# EAGLE design MySXMotion-V1.2-001 (EAGLE 9.1.0)
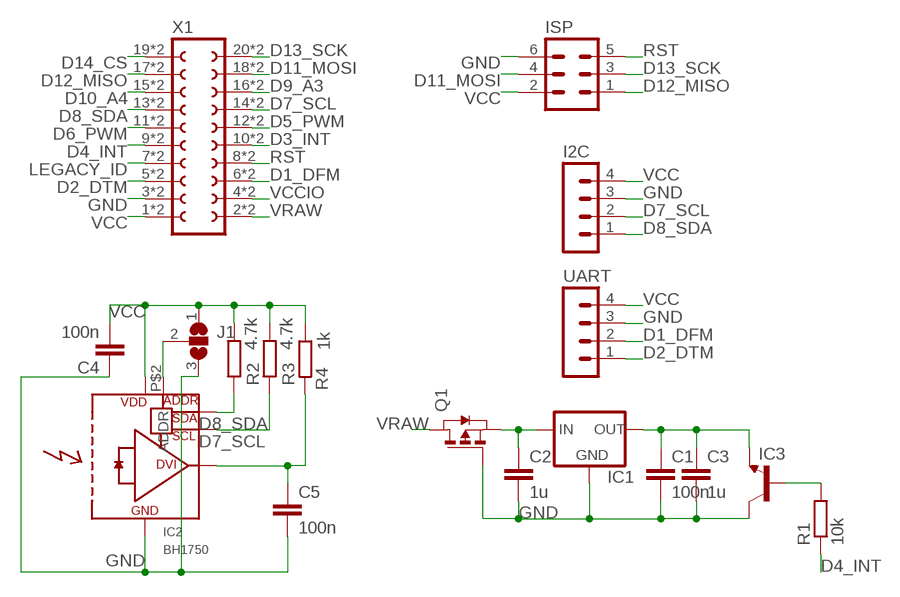
[diagram p0: schematic, sheet 1]

## Parts
C1  100n  C-EUC0603  [C0603]
C2  1u  C-EUC0603  [C0603]
C3  1u  C-EUC0805  [C0805]
C4  100n  C-EUC0603  [C0603]
C5  100n  C-EUC0603  [C0603]
I2C  MA04-1  [MA04-1]
IC1  XC63FPM  [SOT23]
IC2  BH1750  [WSOF6]
IC3  -NPN-TO5  [TO5]
ISP  MA03-2  [MA03-2]
J1  SJ2W  [SJ_2]
Q1  PMOSSOT23  [SOT-23]
R1  10k  R-EU_R0603  [R0603]
R2  4.7k  R-EU_R0603  [R0603]
R3  4.7k  R-EU_R0603  [R0603]
R4  1k  R-EU_R0603  [R0603]
UART  MA04-1  [MA04-1]
X1  FE10-2  [FE10-2]

## Nets
D1_DFM: UART.2 X1.6 X1.P$6
D2_DTM: UART.1 X1.5 X1.P$5
D3_INT: X1.10 X1.P$10
D4_INT: R1.1 X1.9 X1.P$9
D5_PWM: X1.12 X1.P$12
D6_PWM: X1.11 X1.P$11
D7_SCL: I2C.2 IC2.P$6(SCL) R3.1 X1.14 X1.P$14
D8_SDA: I2C.1 IC2.P$4(SDA) R2.1 X1.13 X1.P$13
D9_A3: X1.16 X1.P$16
D10_A4: X1.15 X1.P$15
D11_MOSI: ISP.4 X1.18 X1.P$18
D12_MISO: ISP.1 X1.17 X1.P$17
D13_SCK: ISP.3 X1.20 X1.P$20
D14_CS: X1.19 X1.P$19
GND [power]: C1.2 C2.2 C3.2 C4.1 C5.2 I2C.3 IC1.1(GND) IC2.P$3(GND) IC3.3(C) ISP.6 J1.3 Q1.3(G) UART.3 X1.3 X1.P$3
LEGACY_ID: X1.7 X1.P$7
N$1: C5.1 IC2.P$5(DVI) R4.2
N$2: IC2.P$2(ADDR) J1.2
N$3: IC3.2(B) R1.2
N$4 [power]: C2.1 IC1.3(IN) Q1.2(S)
N$7 [power]: C1.1 C3.1 IC1.2(OUT) IC3.1(E)
RST: ISP.5 X1.8 X1.P$8
VCC [power]: C4.2 I2C.4 IC2.P$1(VCC) ISP.2 J1.1 R2.2 R3.2 R4.1 UART.4 X1.1 X1.P$1
VCCIO [power]: X1.4 X1.P$4
VRAW [power]: Q1.1(D) X1.2 X1.P$2

## Library data of the parts
C1-C5 = rcl:C-EU: CAPACITOR, European symbol
I2C UART = con-lstb:MA04-1: PIN HEADER; OC_FARNELL: unknown; OC_NEWARK: unknown
IC1 = v-reg:XC63FP: Positiv Voltage Regulators www.torex.co.jp/english/product/pro02/pdf/0201_xc62fp.pdf
IC2 = bh1750:BH1750
IC3 = transistor:*-NPN-: NPN Transistror BF959 corrected 2008.03.06
ISP = con-lstb:MA03-2: PIN HEADER; OC_FARNELL: unknown; OC_NEWARK: unknown
J1 = jumper:SJ2W: SMD solder JUMPER
Q1 = zetex:PMOSSOT23: MOS FET; OC_FARNELL: unknown; OC_NEWARK: unknown
R1-R4 = rcl:R-EU_: RESISTOR, European symbol
X1 = my-con-lsta:FE10-2: FEMALE HEADER; OC_FARNELL: unknown; OC_NEWARK: unknown

## Net classes
0 default: width 0.305 mm
1 power: width 0.508 mm

## Board
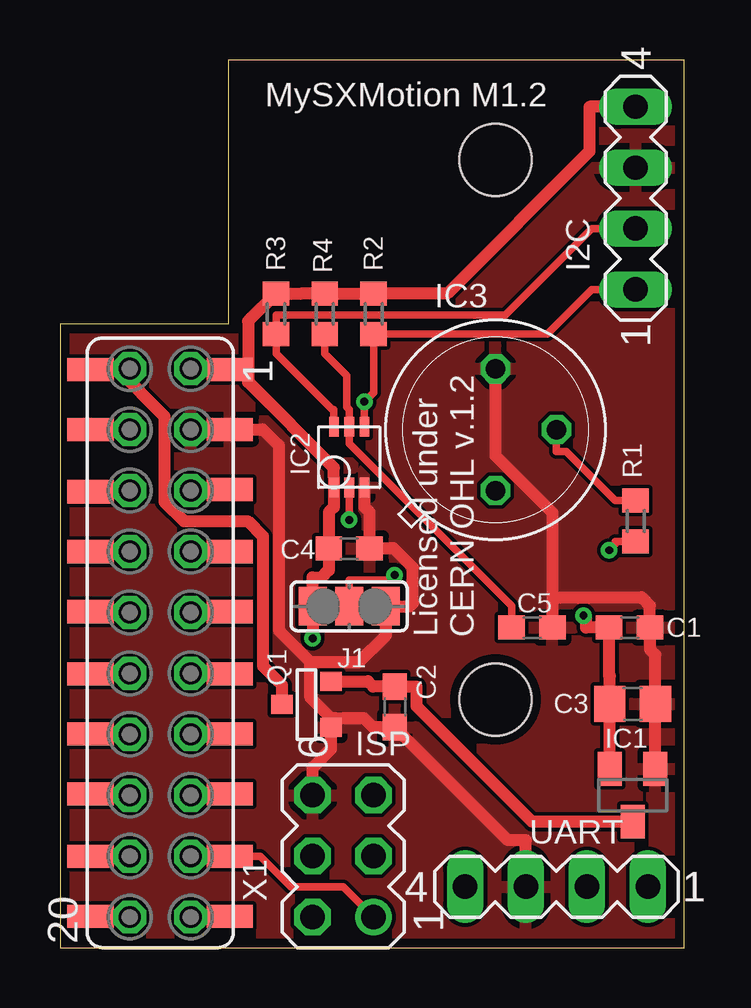
[diagram p1: board, top side]
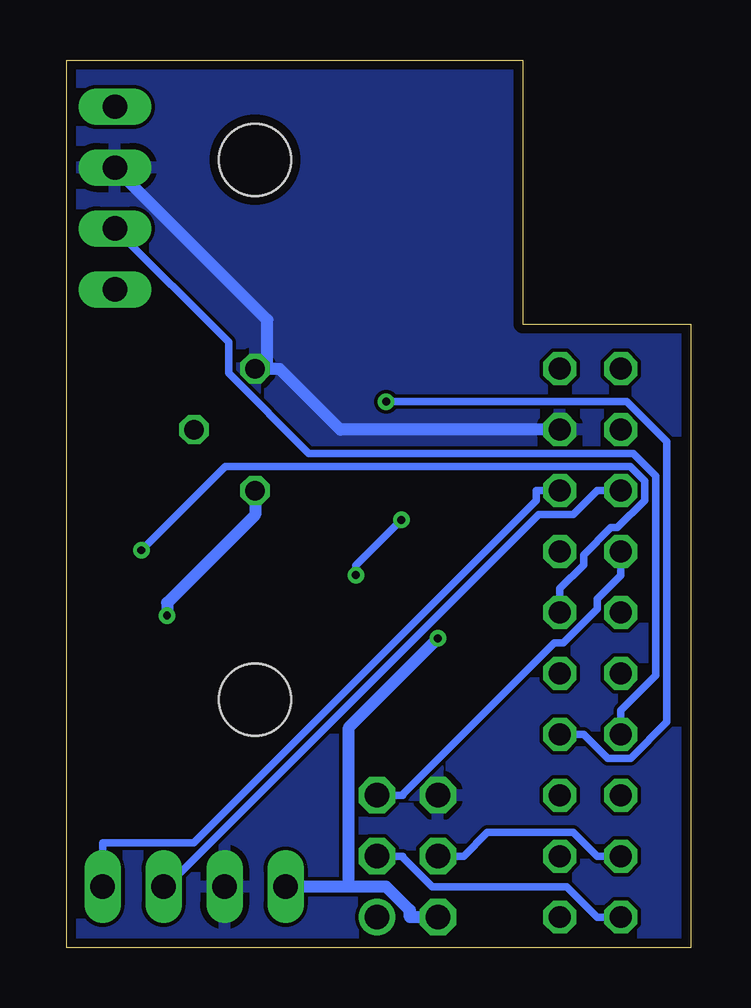
[diagram p2: board, bottom side, seen from below]

Size 26 x 37 mm. Coordinates in mm from the lower left corner, seen from the top.
Outline: 0,0 26,0 26,37 7,37 7,26 0,26 0,0
Copper layers (1*16): Top 0.0356mm / dielectric 1.5011mm / Bottom 0.0356mm
Design rules "PCBs_io": minimum track width 6mil, minimum drill 13mil, track to track 6mil, track to pad 6mil, pad to pad 6mil, via to via 6mil, smd to smd 6mil, copper to edge 15mil, drill to drill 6mil, minimum pad ring 7mil, minimum via ring 7mil, stop-mask expansion 3mil, vias tented up to drill 0mil, thermal gap 10mil
Holes 3 mm at 18.14,10.34 18.14,32.84

### Footprints (pad centres in the part's own frame; a part is rotated, then mirrored left to right if it is on the bottom)
C0603 = smd 1.1 x 1: 1 -0.85,0; 2 0.85,0
C0805 = smd 1.3 x 1.5: 1 -0.95,0; 2 0.95,0
MA04-1 = drill 1.016 long: 1 -3.81,0; 2 -1.27,0; 3 1.27,0; 4 3.81,0
SOT23 = smd 1 x 1.4: 1 -0.95,-1.1; 2 0.95,-1.1; 3 0,1.1
WSOF6 = smd 0.406 x 0.813: P$1 -0.635,-1.27; P$2 0,-1.27; P$3 0.635,-1.27; P$4 0.635,1.27; P$5 0,1.27; P$6 -0.635,1.27
TO5 = drill 0.813 octagon: 1 0,-2.54; 2 2.54,0; 3 0,2.54
MA03-2 = drill 1.016: 1 -2.54,-1.27 | drill 1.016 octagon: 2 -2.54,1.27; 3 0,-1.27; 4 0,1.27; 5 2.54,-1.27; 6 2.54,1.27
SJ_2 = smd 1.168 x 1.6: 1 -1.524,0; 2 0,0; 3 1.524,0
SOT-23 = smd 0.787 x 0.889: 1 0.025,-1.016; 2 -0.94,1.016; 3 0.991,1.016
R0603 = smd 1 x 1.1: 1 -0.85,0; 2 0.85,0
FE10-2 = drill 0.914 octagon: 1 -11.43,1.27; 2 -11.43,-1.27; 3 -8.89,1.27; 4 -8.89,-1.27; 5 -6.35,1.27; 6 -6.35,-1.27; 7 -3.81,1.27; 8 -3.81,-1.27; 9 -1.27,1.27; 10 -1.27,-1.27; 11 1.27,1.27; 12 1.27,-1.27; 13 3.81,1.27; 14 3.81,-1.27; 15 6.35,1.27; 16 6.35,-1.27; 17 8.89,1.27; 18 8.89,-1.27; 19 11.43,1.27; 20 11.43,-1.27 | smd 0.965 x 1.93: P$1 -11.4,2.9; P$2 -11.4,-2.9; P$3 -8.9,2.9; P$4 -8.9,-2.9; P$5 -6.4,2.9; P$6 -6.3,-2.9; P$7 -3.8,2.9; P$8 -3.8,-2.9; P$9 -1.3,2.9; P$10 -1.3,-2.9; P$11 1.3,2.9; P$12 1.3,-2.9; P$13 3.8,2.9; P$14 3.8,-2.9; P$15 6.3,2.9; P$16 6.3,-2.9; P$17 8.9,2.9; P$18 8.9,-2.9; P$19 11.4,2.9; P$20 11.4,-2.9

### Placement (x,y rotation side)
C1  23.73,13.34 0 top
C2  13.95,10.03 270 top
C3  23.86,10.16 0 top
C4  12.05,16.64 180 top
C5  19.67,13.34 0 top
I2C  23.99,31.24 90 top
IC1  23.86,6.35 180 top
IC2  12.05,20.45 0 top
IC3  18.14,21.59 0 top
ISP  11.79,3.81 90 top
J1  12.05,14.22 0 top
Q1  10.27,10.16 270 top
R1  23.99,17.78 90 top
R2  13.06,26.42 90 top
R3  9,26.42 90 top
R4  11.03,26.42 270 top
UART  20.68,2.54 180 top
X1  4.17,12.7 270 top

### Tracks (layer width: path | path; a pad name or v marks a point on that pad's centre or on a via)
D1_DFM
  Top 0.305: X1.6 1.91,19.05 1.86,19 X1.P$6
  Bottom 0.305: X1.6 3.9,19.05 4.89,18.06 6.33,18.06 21.85,2.54 UART.2
D2_DTM
  Top 0.305: X1.5 6.44,19.05 6.49,19.1 X1.P$5
  Bottom 0.305: UART.1 24.5,4.37 20.7,4.37 6.44,18.63 6.44,19.05 X1.5
D3_INT
  Top 0.305: X1.10 1.91,13.97 1.88,14 X1.P$10
D4_INT  (via drill 0.33 pad 0.69)
  Top 0.305: R1.1 23.13,16.93 23.13,16.81 v22.88,16.56 | X1.P$9 6.47,14 6.44,13.97 X1.9
  Bottom 0.305: X1.9 5.45,14.96 4.45,15.95 4.45,16.37 3.32,17.5 3.05,17.5 1.91,18.64 1.91,19.45 2.5,20.05 19.39,20.05 v22.88,16.56
D5_PWM
  Top 0.305: X1.12 1.91,11.43 1.88,11.4 X1.P$12
D6_PWM
  Top 0.305: X1.11 6.44,11.43 6.47,11.4 X1.P$11
D7_SCL
  Top 0.305: X1.14 1.91,8.89 1.9,8.9 X1.P$14 | I2C.2 22.16,29.97 18.56,26.37 9,26.37 R3.1 9,24.76 11.33,22.43 11.41,22.43 11.41,21.96 IC2.P$6
  Bottom 0.305: X1.14 2.91,9.88 1.45,11.33 1.45,19.65 2.4,20.6 15.91,20.6 19.25,23.94 19.25,25.23 I2C.2
D8_SDA  (via drill 0.33 pad 0.69)
  Top 0.305: I2C.1 22.16,27.43 20.29,25.57 R2.1 13.06,23.13 v12.68,22.75 IC2.P$4 | X1.P$13 6.45,8.9 6.44,8.89 X1.13
  Bottom 0.305: X1.13 4.45,8.89 3.46,7.89 2.5,7.89 0.99,9.4 0.99,21.08 2.66,22.75 v12.68,22.75
D9_A3
  Top 0.305: X1.16 1.91,6.35 1.86,6.4 X1.P$16
D10_A4
  Top 0.305: X1.15 6.44,6.35 6.49,6.4 X1.P$15
D11_MOSI
  Top 0.305: X1.18 1.91,3.81 1.9,3.8 X1.P$18
  Bottom 0.305: ISP.4 9.46,3.81 8.47,4.8 4.89,4.8 3.9,3.81 X1.18
D12_MISO
  Top 0.305: ISP.1 11.79,2.54 9.61,2.54 8.34,3.8 X1.P$17 6.45,3.8 6.44,3.81 X1.17
D13_SCK
  Top 0.305: X1.20 1.91,1.27 1.88,1.3 X1.P$20
  Bottom 0.305: ISP.3 12,3.81 12,3.77 10.77,2.54 5.17,2.54 3.9,1.27 X1.20
D14_CS
  Top 0.305: X1.19 6.44,1.27 6.47,1.3 X1.P$19
GND
  Top 0.508: 10.44,11.9 12.46,11.9 13.57,13.02 J1.3 14.56,14.22 14.7,14.36 14.7,15.84 13.9,16.64 C4.1 12.9,18.15 12.68,18.36 IC2.P$3 | 10.44,11.9 9.12,13.22 9.12,20.93 8.45,21.6 X1.P$3 6.55,21.6 6.54,21.59 X1.3 | 11.29,9.57 10.44,10.42 10.44,11.9 | 20.52,14.6 C5.2 | IC3.3 18.14,20.5 20.52,18.13 20.52,14.6 | 20.52,14.6 24.23,14.6 24.58,14.24 C1.2 24.58,12.43 24.81,12.2 C3.2 IC1.1 | UART.3 19.41,4.47 18.67,4.47 C2.2 13.05,9.18 12.66,9.57 11.29,9.57 | 11.29,9.57 Q1.3 11.29,8.77 11.29,8.28 10.53,7.52 ISP.6
  Bottom 0.508: 17.64,24.13 17.64,26.16 I2C.3 | 17.64,24.13 17.13,24.13 14.59,21.59 X1.3 | IC3.3 17.64,24.13
  pour Bottom: -0.27,0 26.4,0 26.4,36.64 7.1,36.64 7.1,25.91 -0.27,25.91
  pour Top: -0.27,0 26.4,0 26.4,36.64 7.1,36.64 7.1,25.91 -0.27,25.91
LEGACY_ID
  Top 0.305: X1.7 6.44,16.51 6.45,16.5 X1.P$7
N$1
  Top 0.305: C5.1 18.82,14.24 12.05,21.01 IC2.P$5 12.05,22.43 11.95,22.52 11.95,23.84 11.03,24.76 R4.2
N$2  (via drill 0.33 pad 0.69)
  Top 0.305: IC2.P$2 v12.05,17.82 | v13.94,15.53 13.74,15.33 12.05,15.33 J1.2
  Bottom 0.305: v13.94,15.53 13.94,15.93 v12.05,17.82
N$3
  Top 0.305: IC3.2 20.68,20.68 21.09,20.68 23.13,18.63 R1.2
N$4
  Top 0.508: IC1.3 19.67,5.25 14.86,10.06 14.86,10.88 C2.1 13.05,10.88 12.83,11.1 Q1.2
N$7  (via drill 0.33 pad 0.69)
  Top 0.508: v21.81,13.84 21.93,13.73 21.93,13.34 C1.1 22.88,11.34 22.91,11.32 C3.1 IC1.2
  Bottom 0.508: IC3.1 18.14,18.03 21.81,14.37 v21.81,13.84 | v21.81,13.84
RST
  Top 0.305: X1.8 1.91,16.51 1.9,16.5 X1.P$8
  Bottom 0.305: ISP.5 12,6.35 12,6.39 5.69,12.7 5.31,12.7 3.9,14.12 3.9,14.53 2.91,15.52 X1.8
VCC  (via drill 0.33 pad 0.69)
  Top 0.508: v10.53,12.89 10.53,13.02 10.53,13.62 J1.1 10.53,15.43 10.9,15.43 11.2,15.73 C4.2 11.2,18.15 11.41,18.36 IC2.P$1 11.41,19.58 11.41,19.99 7.84,23.56 7.84,24.1 | 7.84,24.1 7.84,26.11 R3.2 10.08,27.27 R4.1 R2.2 16.13,27.27 22.06,33.19 22.06,35.05 I2C.4 | 7.84,24.1 X1.P$1 6.57,24.1 6.54,24.13 X1.1
  Bottom 0.508: 14.24,2.54 14.24,9.17 v10.53,12.89 | 14.24,2.54 UART.4 | 14.24,2.54 12.68,2.54 11.69,1.55 11.69,1.27 ISP.2
VCCIO
  Top 0.508: X1.4 1.81,21.59 1.8,21.6 X1.P$4
VRAW
  Top 0.508: Q1.1 9.26,10.94 8.46,11.73 8.46,17.14 7.82,17.78 5.17,17.78 4.35,18.59 4.35,22.14 2.36,24.13 | 2.36,24.13 1.81,24.13 1.78,24.1 X1.P$2 | X1.2 2.36,24.13

### Text on the board
tPlace: Licensed under / CERN OHL v.1.2
tNames: MySXMotion M1.2